# Altium schematic sheet OverTempProtection.SchDoc: Over Temperature Protection
size A4; CheckedBy: G.Kasprowicz; Author: M.Gaska; CompanyName: WUT ISE; DrawnBy: M.Gaska; Organization: WUT ISE; Address1: PW ISE; Address2: Nowowiejska 15/19 00-665 Warsaw; Address3: michalgaska2@gmail.com; DocumentNumber: 8; SheetNumber: 7; SheetTotal: 9; ModifiedBy: M. Fafara; CheckedDate: -; Title2: v2.0; DivGrp: WUT ISE; Designer: M.Gaska; ModifiedDate: -; ProjectName: Sensor Box
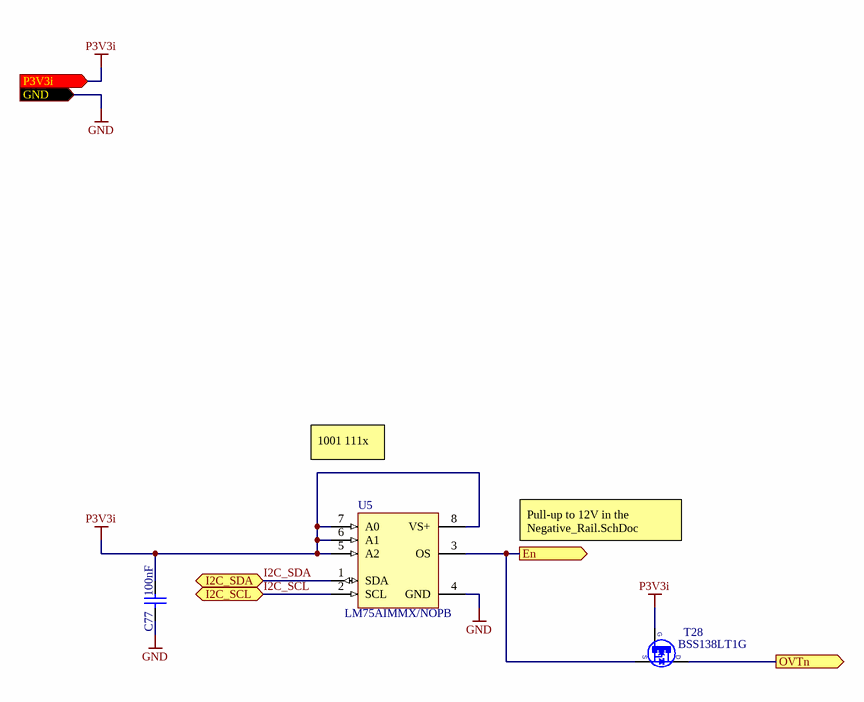
[diagram p0: OverTempProtection.SchDoc]

## Parts
C77  100nF  [CAPC1608X87N]
T28  BSS138LT1G  [SOT95P240X110-3N]
U5  LM75AIMMX/NOPB  [DGK0008A_M]

## Ports
En (out), GND (in), I2C_SCL (bidir), I2C_SDA (bidir), OVTn (out), P3V3i (in)

## Nets
GND: C77.1 U5.4(GND) ; port GND
P3V3i: C77.2 T28.1(G) U5.5(A2) U5.6(A1) U5.7(A0) U5.8(VS+) ; port P3V3i
En: T28.2(S) U5.3(OS) ; port En
I2C_SCL: U5.2(SCL) ; port I2C_SCL
I2C_SDA: U5.1(SDA) ; port I2C_SDA
OVTn: T28.3(D) ; port OVTn

## Notes on the sheet
- 1001 111x
- Pull-up to 12V in the Negative_Rail.SchDoc
- Project/Equipment
- Document
- Designer
- Drawn by
- Check.by
- Copyright WUT ISE 2020.
  This documentation describes Open Hardware and is licensed under the CERN OHL v.1.2. You may redistribute and modify this documentation under the terms of the CERN OHL v.1.2. (http://ohwr.org/CERNOHL). This documentation is distributed WITHOUT ANY EXPRESS OR IMPLIED WARRANTY, INCLUDING OF MERCHANTABILITY, SATISFACTORY QUALITY AND FITNESS FOR A PARTICULAR PURPOSE. Please see the CERN OHL v.1.2 for applicable conditions.
- Contact
- File
- Last Mod.
- Print Date
- Sheet
- Size
- A3
- of
- Rev

## Library data of the parts
C77 = CC0603_100NF_50V_10%_X7R: Non-polarised capacitor; Part Description: SMD Multilayer Chip Ceramic Capacitor; Manufacturer: GENERIC; Manufacturer1 Part Number: 223858615649; Voltage: 50V; TC: X7R; Tolerance: ±10%; Part Number: CC0603_100NF_50V_10%_X7R; Component Kind: Standard; Component Type: Standard; Pin Count: 2; Value: 100nF; Status: Preferred; Manufacturer Part Number: CC0603_100NF_50V_10%_X7R; Case: 0603; Mounted: Yes; Socket: No; SMD: Yes; Sense: No; Manufacturer1 Example: PHYCOMP; Manufacturer1 ComponentHeight: 0.87mm; HelpURL: \\cern.ch\dfs\Applications\Altium\Datasheets\CC0603_X7R_PHYCOMP.pdf; Author: CERN DEM JLC; CreateDate: 03.12.2007; LatestRevisionDate: 03.12.2007
T28 = BSS138LT1G: N-CHANNEL MOSFET WITH DIODE; Part Description: 50V, 200mA N-Channel Enhancement Mode Field-Effect Transistor; Manufacturer: ON SEMICONDUCTOR; PressFit: No; Bonding: No; Part Number: BSS138LT1G; Component Kind: Standard; Component Type: Standard; Device: BSS138LT1G; PackageDescription: SOT23, 0.95mm Pitch; 3 Pin, 1.40mm W X 3.00mm L X 1.10mm H body, IPC Medium Density; Manufacturer Part Number: BSS138L; Pin Count: 3; Case: SOT23-3; Mounted: Yes; Socket: No; SMD: Yes; Sense: No; ComponentHeight: 1.11mm; HelpURL: \\cern.ch\dfs\Applications\Altium\Datasheets\BSS138LT1G.pdf; Author: CERN DEM JLC; CreateDate: 23.03.2009; LatestRevisionDate: 25.05.2022
U5 = CMP-010-00652-1: Serial Switch/Digital Sensor, 9 Bit(s), 3Cel, Square, 8 Pin, Surface Mount; Sensor Type: TEMPERATURE SENSOR,SWITCH/DIGITAL OUTPUT,SERIAL; Min Supply Voltage: 2.7V; Max Supply Voltage: 5.5V; Min Operating Temperature: -55°C; Mounting Technology: Surface Mount; Pins: 8; RoHS Compliant: Yes; Max Operating Temperature: 125°C